# Altium project SmartEE.PrjPcb
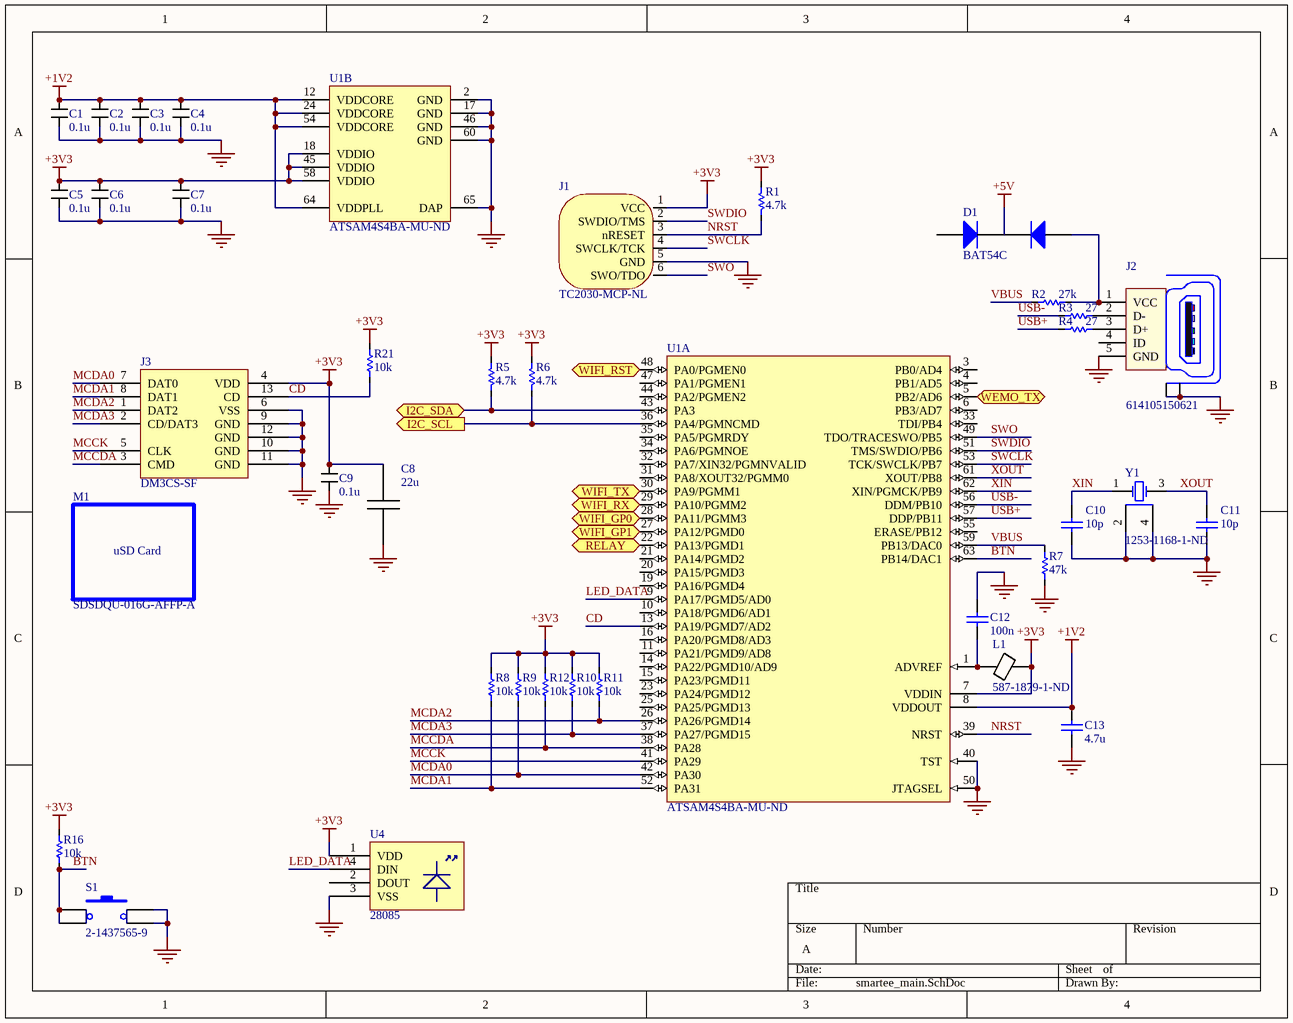
[diagram p0: smartee_main.SchDoc]
2 sheets, 57 parts. Net scope: flat (ports and power ports of the same name join across sheets).
Board file: smartee.PcbDoc
Sheets:
  smartee_main.SchDoc
  smartee_periph.SchDoc

## Sheet smartee_main.SchDoc
size A

### Parts
C1  0.1u  [R0603]
C2  0.1u  [R0603]
C3  0.1u  [R0603]
C4  0.1u  [R0603]
C5  0.1u  [R0603]
C6  0.1u  [R0603]
C7  0.1u  [R0603]
C8  22u  [0805]
C9  0.1u  [R0603]
C10  value 10p  [0603]  (hidden comment: CAP)
C11  value 10p  [0603]  (hidden comment: CAP)
C12  value 100n  [0603]  (hidden comment: CAP)
C13  value 4.7u  [0603]  (hidden comment: CAP)
D1  BAT54C  [SOT23]
J1  TC2030-MCP-NL  [TC2030-MCP-NL]  (no BOM)
J2  614105150621  [614105150621]
J3  DM3CS-SF  [DM3CS-SF]
L1  Supplier Part Number 1: 587-1879-1-ND  [0603]  (hidden comment: Ferrite)
M1  SDSDQU-016G-AFFP-A  (mechanical)
R1  value 4.7k  [0603]  (hidden comment: RES)
R2  value 27k  [0603]  (hidden comment: RES)
R3  value 27  [0603]  (hidden comment: RES)
R4  value 27  [0603]  (hidden comment: RES)
R5  value 4.7k  [0603]  (hidden comment: RES)
R6  value 4.7k  [0603]  (hidden comment: RES)
R7  value 47k  [0603]  (hidden comment: RES)
R8  value 10k  [0603]  (hidden comment: RES)
R9  value 10k  [0603]  (hidden comment: RES)
R10  value 10k  [0603]  (hidden comment: RES)
R11  value 10k  [0603]  (hidden comment: RES)
R12  value 10k  [0603]  (hidden comment: RES)
R16  value 10k  [0603]  (hidden comment: RES)
R21  value 10k  [0603]  (hidden comment: RES)
S1  2-1437565-9  [2-1437565-9]
U1  Supplier Part Number 1: ATSAM4S4BA-MU-ND  [QFN64]  (hidden comment: SAM4S)  (parts A,B of 2)
U4  28085  [WS2812B]
Y1  Supplier Part Number 1: 1253-1168-1-ND  [XTAL_3.2x2.5mm]  (hidden comment: XTAL)

### Ports
I2C_SCL (out), I2C_SDA (bidir), RELAY (out), WEMO_TX (in), WIFI_GP0 (bidir), WIFI_GP1 (bidir), WIFI_RST (out), WIFI_RX (out), WIFI_TX (in)

### Nets
+1V2: C1.1 C2.1 C3.1 C4.1 C13.2 U1.8(VDDOUT) U1.12(VDDCORE) U1.24(VDDCORE) U1.54(VDDCORE) U1.64(VDDPLL)
+3V3: C5.1 C6.1 C7.1 C8.1 C9.1 J1.1(VCC) J3.4(VDD) L1.1 R1.1 R5.1 R6.1 R8.2 R9.2 R10.2 R11.2 R12.2 R16.2 R21.2 U1.7(VDDIN) U1.18(VDDIO) U1.45(VDDIO) U1.58(VDDIO) U4.1(VDD)
+5V: D1.3(K)
GND: C1.2 C2.2 C3.2 C4.2 C5.2 C6.2 C7.2 C8.2 C9.2 C10.1 C11.1 C12.2 C13.1 J1.5(GND) J2.5(GND) J2.Z1(Shield) J2.Z2(Shield) J3.6(VSS) J3.9(GND) J3.10(GND) J3.11(GND) J3.12(GND) R7.1 S1.3 S1.4 U1.2(GND) U1.17(GND) U1.40(TST) U1.46(GND) U1.50(JTAGSEL) U1.60(GND) U1.65(DAP) U4.3(VSS) Y1.2(GND) Y1.4(GND)
BTN: R16.1 S1.1 S1.2 U1.63(PB14/DAC1)
CD: J3.13(CD) R21.1 U1.13(PA19/PGMD7/AD2)
LED_DATA: U1.9(PA17/PGMD5/AD0) U4.4(DIN)
MCCDA: J3.3(CMD) R12.1 U1.38(PA28)
MCCK: J3.5(CLK) U1.41(PA29)
MCDA0: J3.7(DAT0) R9.1 U1.42(PA30)
MCDA1: J3.8(DAT1) R8.1 U1.52(PA31)
MCDA2: J3.1(DAT2) R11.1 U1.26(PA26/PGMD14)
MCDA3: J3.2(CD/DAT3) R10.1 U1.37(PA27/PGMD15)
NRST: J1.3(nRESET) R1.2 U1.39(NRST)
SWCLK: J1.4(SWCLK/TCK) U1.53(TCK/SWCLK/PB7)
SWDIO: J1.2(SWDIO/TMS) U1.51(TMS/SWDIO/PB6)
SWO: J1.6(SWO/TDO) U1.49(TDO/TRACESWO/PB5)
USB+: R4.1 U1.57(DDP/PB11)
USB-: R3.1 U1.56(DDM/PB10)
VBUS: R2.1 R7.2 U1.59(PB13/DAC0)
XIN: C10.2 U1.62(XIN/PGMCK/PB9) Y1.1(OSC1)
XOUT: C11.2 U1.61(XOUT/PB8) Y1.3(OSC2)
NetC12_1: C12.1 L1.2 U1.1(ADVREF)
NetD1_1: D1.1(A1) J2.1(VCC) R2.2
NetJ2_2: J2.2(D-) R3.2
NetJ2_3: J2.3(D+) R4.2
NetJ4_1: U1.22(PA13/PGMD1) ; port RELAY
NetJ4_7: U1.5(PB2/AD6) ; port WEMO_TX
NetM3_2: U1.27(PA12/PGMD0) ; port WIFI_GP1
NetM3_3: U1.28(PA11/PGMM3) ; port WIFI_GP0
NetM3_4: U1.29(PA10/PGMM2) ; port WIFI_RX
NetM3_5: U1.30(PA9/PGMM1) ; port WIFI_TX
NetM3_7: U1.48(PA0/PGMEN0) ; port WIFI_RST
NetR5_2: R5.2 U1.43(PA3) ; port I2C_SDA
NetR6_2: R6.2 U1.36(PA4/PGMNCMD) ; port I2C_SCL

Not connected (* = marked no-connect by the designer): D1 2(A2); J2 4(ID); U1 3(PB0/AD4) 4(PB1/AD5) 6(PB3/AD7) 10(PA18/PGMD6/AD1) 11(PA21/PGMD9/AD8) 14(PA22/PGMD10/AD9) 15(PA23/PGMD11) 16(PA20/PGMD8/AD3) 19(PA16/PGMD4) 20(PA15/PGMD3) 21(PA14/PGMD2) 23(PA24/PGMD12) 25(PA25/PGMD13) 31(PA8/XOUT32/PGMM0) 32(PA7/XIN32/PGMNVALID) 33(TDI/PB4) 34(PA6/PGMNOE) 35(PA5/PGMRDY) 44(PA2/PGMEN2) 47(PA1/PGMEN1) 55(ERASE/PB12); U4 2(DOUT)

### Library data of the parts
C1-C7 C9 = CC0603ZRY5V9BB104: CAP CER 0.1UF 50V Y5V 0603; Manufacturer: Yageo; Capacitance: 0.1µF; Tolerance: -20%, +80%; Temperature Coefficient: Y5V (F); Supplier 1: Digi-Key; Manufacturer Part Number: CC0603ZRY5V9BB104; RoHS: RoHS Compliant; Category: Capacitors; Stock 1: 130366; Pricing 1: 1=0.1, 10=0.017, 25=0.012, 100=0.0078, 250=0.0064, 500=0.00546, 1000=0.00426 (USD); Packaging: Cut Tape (CT); Voltage - Rated: 50V; Mounting Type: Surface Mount, MLCC; Operating Temperature: -30°C ~ 85°C; Applications: General Purpose; Ratings: -; Package / Case: 0603 (1608 Metric); Size / Dimension: 0.063" L x 0.031" W (1.60mm x 0.80mm); Height - Seated (Max): -; Thickness (Max): 0.035" (0.90mm); Lead Spacing: -; Features: -; Lead Style: -; ComponentLink1URL: http://www.yageo.com/documents/recent/UPY-GPHC_Y5V_6.3V-to-50V_5_revised.pdf; ComponentLink1Description: http://www.yageo.com/documents/recent/UPY-GPHC_Y5V_6.3V-to-50V_5_revised.pdf; Supplier Part Number 1: 311-1343-1-ND; Value: 0.1u
C8 = CL21A226MAQNNNE: CAP CER 22UF 25V 20% X5R 0805; Manufacturer: Samsung Electro-Mechanics America, Inc; Capacitance: 22µF; Supplier 1: Digi-Key; Manufacturer Part Number: CL21A226MAQNNNE; RoHS: RoHS Compliant; Category: Capacitors; Stock 1: 750834; Pricing 1: 1=0.47, 10=0.411, 25=0.2936, 50=0.2496, 100=0.2055, 250=0.1644, 500=0.14972, 1000=0.13503 (USD); Packaging: Cut Tape (CT); Voltage - Rated: 25V; Tolerance: ±20%; Temperature Coefficient: X5R; Mounting Type: Surface Mount, MLCC; Operating Temperature: -55°C ~ 85°C; Applications: General Purpose; Ratings: -; Package / Case: 0805 (2012 Metric); Size / Dimension: 0.079" L x 0.049" W (2.00mm x 1.25mm); Height - Seated (Max): -; Thickness (Max): 0.055" (1.40mm); Lead Spacing: -; Features: -; Lead Style: -; ComponentLink1URL: http://www.samsungsem.com/servlet/FileDownload?type=spec&file=CL21A226MAQNNNE.pdf; ComponentLink1Description: http://www.samsungsem.com/servlet/FileDownload?type=spec&file=CL21A226MAQNNNE.pdf; Supplier Part Number 1: 1276-2908-1-ND
C10-C13 = CAP: Capacitor; Published: 8-Jun-2000; LatestRevisionDate: 17-Jul-2002; LatestRevisionNote: Re-released for DXP Platform.; Publisher: Altium Limited
D1 = BAT54C: DIODE SCHOTTKY 30V 200MA SOT23; Manufacturer: Fairchild Semiconductor; Diode Configuration: 1 Pair Common Cathode; Voltage - Forward (Vf) (Max) @ If: 800mV @ 100mA; Speed: Small Signal =< 200mA (Io), Any Speed; Reverse Recovery Time (trr): 5ns; Current - Reverse Leakage @ Vr: 2µA @ 25V; Supplier 1: Digi-Key; Manufacturer Part Number: BAT54C; RoHS: RoHS Compliant; Category: Discrete Semiconductor Products; Stock 1: 113590; Pricing 1: 1=0.2, 10=0.183, 25=0.166, 100=0.1196, 250=0.07044, 500=0.05844, 1000=0.03986 (USD); Packaging: Cut Tape (CT); Diode Type: Schottky; Voltage - DC Reverse (Vr) (Max): 30V; Current - Average Rectified (Io) (per Diode): 200mA; Mounting Type: Surface Mount; Package / Case: TO-236-3, SC-59, SOT-23-3; Supplier Device Package: SOT-23-3 (TO-236); ComponentLink1URL: http://www.fairchildsemi.com/ds/BA/BAT54.pdf; ComponentLink1Description: http://www.fairchildsemi.com/ds/BA/BAT54.pdf; Supplier Part Number 1: BAT54CFSCT-ND
J1 = TC2030-MCP-NL: Tag Connect
J2 = 614105150621: CONN RCPT USB TYPE AB; Manufacturer: Wurth Electronics Inc; Connector Type: USB - micro AB; Number of Contacts: 5; Gender: Receptacle; Specifications: USB 2.0; Supplier 1: Digi-Key; Manufacturer Part Number: 614105150621; RoHS: RoHS Compliant; Category: Connectors, Interconnects; Stock 1: 2977; Pricing 1: 1=2.16, 10=1.94, 50=1.8, 100=1.66, 500=1.44 (USD); Packaging: Cut Tape (CT); Mounting Type: Through Hole, Vertical; Features: Board Guide, Shielded; Ingress Protection: -; ComponentLink1URL: http://katalog.we-online.de/em/datasheet/614105150621.pdf; ComponentLink1Description: http://katalog.we-online.de/em/datasheet/614105150621.pdf; Supplier Part Number 1: 732-5959-1-ND
J3 = DM3CS-SF: CONN MICRO SD R/A HING TYPE SMD; Manufacturer: Hirose Electric Co Ltd; Card Type: Secure Digital - microSD™; Number of Positions: 10 (8 + 2); Connector Type: Connector and Ejector; Insertion, Removal Method: Hinged Lid; Supplier 1: Digi-Key; Manufacturer Part Number: DM3CS-SF; RoHS: RoHS Compliant; Category: Connectors, Interconnects; Stock 1: 22015; Pricing 1: 1=1.66, 10=1.509, 25=1.4168, 50=1.3552, 100=1.2936, 250=1.1704, 500=1.078 (USD); Packaging: Cut Tape (CT); Ejector Side: -; Mounting Type: Surface Mount, Right Angle; Features: Switch; Height Above Board: 0.072" (1.83mm); Mounting Feature: Normal, Standard - Top; Contact Finish: Gold; Contact Finish Thickness: -; ComponentLink1URL: http://www.hirose.co.jp/cataloge_hp/e60900232.pdf; ComponentLink1Description: http://www.hirose.co.jp/cataloge_hp/e60900232.pdf; Supplier Part Number 1: HR1972CT-ND
L1 = Ferrite: Ferrite bead; Code_IEC: 1005; Value: 10mH; Published: 8-Jun-2000; LatestRevisionDate: 29-May-2009; LatestRevisionNote: IPC-7351 Footprint Added.; Publisher: Altium Limited; Code_JEITA: 0402; Supplier 1: Digi-Key
M1 = uSD Card: 16 GB uSD Card
R1-R12 R16 R21 = RES: Resistor; Published: 8-Jun-2000; LatestRevisionDate: 17-Jul-2002; LatestRevisionNote: Re-released for DXP Platform.; Publisher: Altium Limited
S1 = 2-1437565-9: SWITCH TACTILE SPST-NO 0.05A 12V; Manufacturer: TE Connectivity; Switch Function: Off-Mom; Contact Rating @ Voltage: 0.05A @ 24VDC; Actuator Type: Standard; Actuator Height off PCB, from Pins: 4.30mm; Actuator Orientation: Top Actuated; Outline: 6.00mm x 6.00mm; Illumination: Non-Illuminated; Operating Force: 260gf; Actuator Material: Polyamide (PA), Nylon; Switch Travel: 0.25mm; Mechanical Life: 100,000 Cycles; Supplier 1: Digi-Key; Manufacturer Part Number: 2-1437565-9; RoHS: RoHS Compliant; Category: Switches; Stock 1: 3222; Pricing 1: 1=0.25, 10=0.245, 25=0.2364, 50=0.228, 100=0.2154, 250=0.20276, 500=0.1943 (USD); Packaging: Cut Tape (CT); Circuit: SPST-NO; Mounting Type: Surface Mount; Termination Style: Gull Wing; Illumination Voltage (Nominal): -; Illumination Type, Color: -; Ingress Protection: -; Features: -; Operating Temperature: -35°C ~ 85°C; ComponentLink1URL: http://www.te.com/commerce/DocumentDelivery/DDEController?Action=srchrtrv&DocNm=2-1437565-7&DocType=Customer+Drawing&DocLang=English; ComponentLink1Description: http://www.te.com/commerce/DocumentDelivery/DDEController?Action=srchrtrv&DocNm=2-1437565-7&DocType=Customer+Drawing&DocLang=English; Supplier Part Number 1: 450-1792-1-ND
U1 = SAM4S: Atmel SAM4S microcontroller, 64 pin; Supplier 1: Digi-Key
U4 = 28085: WS2812 LED MODULE; Manufacturer: Parallax Inc; Wavelength: 623nm Red, 524nm Green, 466nm Blue; Configuration: Square; Voltage - Forward (Vf) (Typ): 2.1V Red, 3.2V Green, 3.2V Blue; Lens Type: Flat; Supplier 1: Digi-Key; Manufacturer Part Number: 28085; RoHS: RoHS Compliant; Category: Optoelectronics; Stock 1: 0; Pricing 1: 1=1.79 (USD); Packaging: -; Type: LED Engine; Color: Red, Green, Blue (RGB); CCT (K): -; Flux @ Current/Temperature - Test: -; Current - Test: -; Temperature - Test: -; Lumens/Watt @ Current - Test: -; Current - Max: -; CRI (Color Rendering Index): -; Viewing Angle: -; Features: -; Size / Dimension: 5.00mm L x 5.00mm W; Height: -; Light Emitting Surface (LES): -; ComponentLink1URL: http://www.parallax.com/sites/default/files/downloads/28085-WS2812B-RGB-LED-Datasheet.pdf; ComponentLink1Description: http://www.parallax.com/sites/default/files/downloads/28085-WS2812B-RGB-LED-Datasheet.pdf; Supplier Part Number 1: 28085-ND
Y1 = XTAL: Crystal Oscillator; Published: 8-Jun-2000; LatestRevisionDate: 17-Jul-2002; LatestRevisionNote: Re-released for DXP Platform.; Publisher: Altium Limited; Supplier 1: Digi-Key

## Sheet smartee_periph.SchDoc
size A
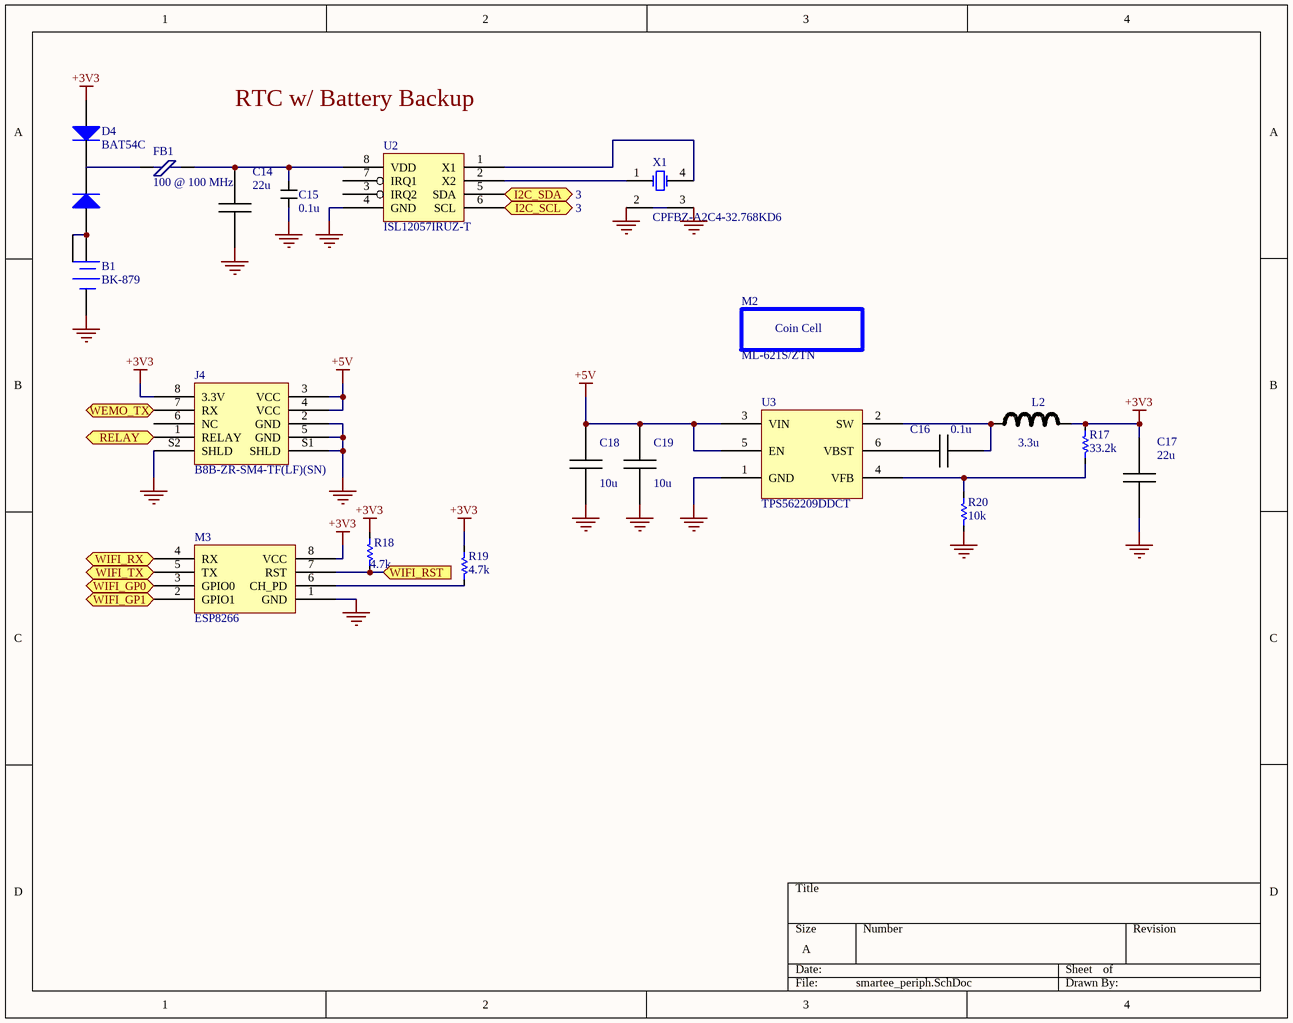
[diagram p1: smartee_periph.SchDoc]

### Parts
B1  BK-879  [BK-879]
C14  22u  [0805]
C15  0.1u  [R0603]
C16  0.1u  [0805]
C17  22u  [1206]
C18  10u  [0805]
C19  10u  [0805]
D4  BAT54C  [SOT23]
FB1  100 @ 100 MHz  [0603]
J4  B8B-ZR-SM4-TF(LF)(SN)  [B8B-ZR-SM4-TF]
L2  3.3u  [0805]
M2  ML-621S/ZTN  (mechanical)
M3  ESP8266  [ESP8266]
R17  value 33.2k  [0603]  (hidden comment: RES)
R18  value 4.7k  [0603]  (hidden comment: RES)
R19  value 4.7k  [0603]  (hidden comment: RES)
R20  value 10k  [0603]  (hidden comment: RES)
U2  ISL12057IRUZ-T  [UTDFN8]
U3  TPS562209DDCT  [TSOP-6]
X1  CPFBZ-A2C4-32.768KD6  [XTAL]

### Ports
I2C_SCL (in, see 3), I2C_SDA (bidir, see 3), RELAY (in), WEMO_TX (out), WIFI_GP0 (bidir), WIFI_GP1 (bidir), WIFI_RST (in), WIFI_RX (in), WIFI_TX (out)

### Nets
+3V3: C17.1 D4.2(A2) J4.8(3.3V) L2.2 M3.8(VCC) R17.1 R18.1 R19.1
+5V: C18.1 C19.1 J4.3(VCC) J4.4(VCC) U3.3(VIN) U3.5(EN)
GND: B1.N C14.2 C15.2 C17.2 C18.2 C19.2 J4.2(GND) J4.5(GND) J4.S1(SHLD) J4.S2(SHLD) M3.1(GND) R20.2 U2.4(GND) U3.1(GND) X1.2 X1.3
NetB1_P1: B1.P1 B1.P2 D4.1(A1)
NetC14_1: C14.1 C15.1 FB1.2 U2.8(VDD)
NetC16_1: C16.1 U3.6(VBST)
NetC16_2: C16.2 L2.1 U3.2(SW)
NetD4_3: D4.3(K) FB1.1
NetJ4_1: J4.1(RELAY) ; port RELAY
NetJ4_7: J4.7(RX) ; port WEMO_TX
NetM3_2: M3.2(GPIO1) ; port WIFI_GP1
NetM3_3: M3.3(GPIO0) ; port WIFI_GP0
NetM3_4: M3.4(RX) ; port WIFI_RX
NetM3_5: M3.5(TX) ; port WIFI_TX
NetM3_6: M3.6(CH_PD) R19.2
NetM3_7: M3.7(RST) R18.2 ; port WIFI_RST
NetR5_2: U2.5(SDA) ; port I2C_SDA
NetR6_2: U2.6(SCL) ; port I2C_SCL
NetR17_2: R17.2 R20.1 U3.4(VFB)
NetU2_1: U2.1(X1) X1.4
NetU2_2: U2.2(X2) X1.1(OSC1)

Not connected (* = marked no-connect by the designer): J4 6(NC); U2 3(IRQ2) 7(IRQ1)

### Notes on the sheet
- RTC w/ Battery Backup
- (in symbol ML-621S/ZTN) Coin Cell

### Library data of the parts
B1 = BK-879: HOLDER 6.8MM COIN CELL SMD; Manufacturer: MPD (Memory Protection Devices); Battery Type, Function: Coin Cell, Retainer; Style: Retainer; Battery Cell Size: Coin, 6.8mm; Number of Cells: 1; Battery Series: 364, 621; Supplier 1: Digi-Key; Manufacturer Part Number: BK-879; RoHS: RoHS Compliant; Category: Battery Products; Stock 1: 1702; Pricing 1: 1=0.32, 10=0.3, 100=0.27, 500=0.24, 1000=0.2 (USD); Mounting Type: PCB, Surface Mount; Termination Style: SMD (SMT) Tab; Height Above Board: 0.110" (2.80mm); Operating Temperature: -; ComponentLink1URL: http://www.memoryprotectiondevices.com/datasheets/BK-879-datasheet.pdf; ComponentLink1Description: http://www.memoryprotectiondevices.com/datasheets/BK-879-datasheet.pdf; Supplier Part Number 1: BK-879-ND
C14 = CL21A226MAQNNNE: as C8 on sheet smartee_main; Supplier 1: Digi-Key; Manufacturer Part Number: CL21A226MAQNNNE; RoHS: RoHS Compliant; Category: Capacitors; Stock 1: 750834; Pricing 1: 1=0.47, 10=0.411, 25=0.2936, 50=0.2496, 100=0.2055, 250=0.1644, 500=0.14972, 1000=0.13503 (USD); Packaging: Cut Tape (CT); Voltage - Rated: 25V; Tolerance: ±20%; Temperature Coefficient: X5R; Mounting Type: Surface Mount, MLCC; Operating Temperature: -55°C ~ 85°C; Applications: General Purpose; Ratings: -; Package / Case: 0805 (2012 Metric); Size / Dimension: 0.079" L x 0.049" W (2.00mm x 1.25mm); Height - Seated (Max): -; Thickness (Max): 0.055" (1.40mm); Lead Spacing: -; Features: -; Lead Style: -; ComponentLink1URL: http://www.samsungsem.com/servlet/FileDownload?type=spec&file=CL21A226MAQNNNE.pdf; ComponentLink1Description: http://www.samsungsem.com/servlet/FileDownload?type=spec&file=CL21A226MAQNNNE.pdf; Supplier Part Number 1: 1276-2908-1-ND
C15 = CC0603ZRY5V9BB104: as C1 on sheet smartee_main; Supplier 1: Digi-Key; Manufacturer Part Number: CC0603ZRY5V9BB104; RoHS: RoHS Compliant; Category: Capacitors; Stock 1: 130366; Pricing 1: 1=0.1, 10=0.017, 25=0.012, 100=0.0078, 250=0.0064, 500=0.00546, 1000=0.00426 (USD); Packaging: Cut Tape (CT); Voltage - Rated: 50V; Mounting Type: Surface Mount, MLCC; Operating Temperature: -30°C ~ 85°C; Applications: General Purpose; Ratings: -; Package / Case: 0603 (1608 Metric); Size / Dimension: 0.063" L x 0.031" W (1.60mm x 0.80mm); Height - Seated (Max): -; Thickness (Max): 0.035" (0.90mm); Lead Spacing: -; Features: -; Lead Style: -; ComponentLink1URL: http://www.yageo.com/documents/recent/UPY-GPHC_Y5V_6.3V-to-50V_5_revised.pdf; ComponentLink1Description: http://www.yageo.com/documents/recent/UPY-GPHC_Y5V_6.3V-to-50V_5_revised.pdf; Supplier Part Number 1: 311-1343-1-ND; Value: 0.1u
C16 = 08053C104KAT2A: CAP CER 0.1UF 25V 10% X7R 0805; Manufacturer: AVX Corporation; Capacitance: 0.1µF; Supplier 1: Digi-Key; Manufacturer Part Number: 08053C104KAT2A; RoHS: RoHS Compliant; Category: Capacitors; Stock 1: 1175205; Pricing 1: 1=0.1, 10=0.066, 100=0.0303, 250=0.02476, 500=0.02118, 1000=0.0165 (USD); Packaging: Cut Tape (CT); Tolerance: ±10%; Voltage - Rated: 25V; Temperature Coefficient: X7R; Mounting Type: Surface Mount, MLCC; Operating Temperature: -55°C ~ 125°C; Applications: General Purpose; Ratings: -; Package / Case: 0805 (2012 Metric); Size / Dimension: 0.079" L x 0.049" W (2.01mm x 1.25mm); Height - Seated (Max): -; Thickness (Max): 0.037" (0.94mm); Lead Spacing: -; Features: -; Lead Style: -; ComponentLink1URL: http://www.avx.com/docs/Catalogs/cx7r.pdf; ComponentLink1Description: http://www.avx.com/docs/Catalogs/cx7r.pdf; Supplier Part Number 1: 478-3755-1-ND
C17 = C3216X5R0J226K/1.6: CAP CER 22UF 6.3V 10% X5R 1206; Manufacturer: TDK Corporation; Capacitance: 22µF; Supplier 1: Digi-Key; Manufacturer Part Number: C3216X5R0J226K/1.6; RoHS: RoHS Compliant; Category: Capacitors; Stock 1: 117320; Pricing 1: 1=0.48, 10=0.42, 100=0.21, 250=0.168, 500=0.153, 1000=0.138 (USD); Packaging: Cut Tape (CT); Tolerance: ±10%; Voltage - Rated: 6.3V; Temperature Coefficient: X5R; Mounting Type: Surface Mount, MLCC; Operating Temperature: -55°C ~ 85°C; Applications: General Purpose; Ratings: -; Package / Case: 1206 (3216 Metric); Size / Dimension: 0.126" L x 0.063" W (3.20mm x 1.60mm); Height - Seated (Max): -; Thickness (Max): 0.071" (1.80mm); Lead Spacing: -; Features: -; Lead Style: -; ComponentLink1URL: http://media.digikey.com/pdf/Data%20Sheets/TDK%20PDFs/C_Series_GeneralAppl_B11.pdf; ComponentLink1Description: http://media.digikey.com/pdf/Data%20Sheets/TDK%20PDFs/C_Series_GeneralAppl_B11.pdf; Supplier Part Number 1: 445-4059-1-ND
C18 C19 = C0805C106K8PACTU: CAP CER 10UF 10V 10% X5R 0805; Manufacturer: Kemet; Capacitance: 10µF; Supplier 1: Digi-Key; Manufacturer Part Number: C0805C106K8PACTU; RoHS: RoHS Compliant; Category: Capacitors; Stock 1: 172957; Pricing 1: 1=0.21, 10=0.14, 50=0.085, 100=0.0714, 250=0.0578, 500=0.051, 1000=0.04335 (USD); Packaging: Cut Tape (CT); Tolerance: ±10%; Voltage - Rated: 10V; Temperature Coefficient: X5R; Mounting Type: Surface Mount, MLCC; Operating Temperature: -55°C ~ 85°C; Applications: General Purpose; Ratings: -; Package / Case: 0805 (2012 Metric); Size / Dimension: 0.079" L x 0.049" W (2.00mm x 1.25mm); Height - Seated (Max): -; Thickness (Max): 0.055" (1.40mm); Lead Spacing: -; Features: -; Lead Style: -; ComponentLink1URL: http://www.kemet.com/docfinder?Partnumber=C0805C106K8PACTU; ComponentLink1Description: http://www.kemet.com/docfinder?Partnumber=C0805C106K8PACTU; Supplier Part Number 1: 399-4925-1-ND
D4 = BAT54C: as D1 on sheet smartee_main; Supplier 1: Digi-Key; Manufacturer Part Number: BAT54C; RoHS: RoHS Compliant; Category: Discrete Semiconductor Products; Stock 1: 113590; Pricing 1: 1=0.2, 10=0.183, 25=0.166, 100=0.1196, 250=0.07044, 500=0.05844, 1000=0.03986 (USD); Packaging: Cut Tape (CT); Diode Type: Schottky; Voltage - DC Reverse (Vr) (Max): 30V; Current - Average Rectified (Io) (per Diode): 200mA; Mounting Type: Surface Mount; Package / Case: TO-236-3, SC-59, SOT-23-3; Supplier Device Package: SOT-23-3 (TO-236); ComponentLink1URL: http://www.fairchildsemi.com/ds/BA/BAT54.pdf; ComponentLink1Description: http://www.fairchildsemi.com/ds/BA/BAT54.pdf; Supplier Part Number 1: BAT54CFSCT-ND
FB1 = MPZ1608S101ATAH0: FERRITE CHIP 100 OHM 3A 0603; Manufacturer: TDK Corporation; Impedance @ Frequency: 100 Ohm @ 100MHz; DC Resistance (DCR): 30 mOhm Max; Filter Type: Differential Mode - Single; Supplier 1: Digi-Key; Manufacturer Part Number: MPZ1608S101ATAH0; RoHS: RoHS Compliant; Category: Filters; Stock 1: 219330; Pricing 1: 1=0.1, 10=0.079, 100=0.0472, 250=0.03432, 500=0.03146, 1000=0.02717 (USD); Packaging: Cut Tape (CT); Current Rating: 3A; Package / Case: 0603 (1608 Metric); Mounting Type: Surface Mount; Height (Max): 0.030" (0.75mm); Size / Dimension: 0.063" L x 0.031" W (1.60mm x 0.80mm); ComponentLink1URL: http://product.tdk.com/en/catalog/datasheets/beads_commercial_power_mpz_en.pdf; ComponentLink1Description: http://product.tdk.com/en/catalog/datasheets/beads_commercial_power_mpz_en.pdf; Supplier Part Number 1: 445-1564-1-ND
J4 = B8B-ZR-SM4-TF(LF)(SN): CONN HEADER ZH TOP 8POS 1.5MM; Manufacturer: JST Sales America Inc; Connector Type: Header, Shrouded; Number of Positions: 8; Number of Positions Loaded: All; Pitch: 0.059" (1.50mm); Supplier 1: Digi-Key; Manufacturer Part Number: B8B-ZR-SM4-TF(LF)(SN); RoHS: RoHS Compliant; Category: Connectors, Interconnects; Stock 1: 9275; Pricing 1: 1=0.84, 10=0.74, 25=0.6968, 50=0.6678, 100=0.6388, 250=0.58068, 500=0.52262 (USD); Packaging: Cut Tape (CT); Contact Type: Male Pin; Number of Rows: 1; Row Spacing: -; Contact Mating Length: -; Mounting Type: Surface Mount; Termination: Solder; Fastening Type: Detent Lock; Features: Solder Retention; Contact Finish: Tin; Contact Finish Thickness: -; Color: Natural; ComponentLink1URL: http://www.jst-mfg.com/product/pdf/eng/eZH.pdf; ComponentLink1Description: http://www.jst-mfg.com/product/pdf/eng/eZH.pdf; Supplier Part Number 1: 455-1687-1-ND
L2 = MLP2012S3R3MT0S1: FIXED IND 3.3UH 900MA 190 MOHM; Manufacturer: TDK Corporation; Type: Multilayer; Material - Core: Ferrite; Inductance: 3.3µH; Tolerance: ±20%; Shielding: Shielded; Frequency - Test: 2MHz; Supplier 1: Digi-Key; Manufacturer Part Number: MLP2012S3R3MT0S1; RoHS: RoHS Compliant; Category: Inductors, Coils, Chokes; Stock 1: 8776; Pricing 1: 1=0.36, 10=0.328, 50=0.2548, 100=0.2366, 500=0.20748, 1000=0.16744 (USD); Packaging: Cut Tape (CT); Current Rating: 900mA; Current - Saturation: -; DC Resistance (DCR): 190 mOhm; Q @ Freq: -; Frequency - Self Resonant: -; Operating Temperature: -40°C ~ 125°C; Mounting Type: Surface Mount; Package / Case: 0805 (2012 Metric); Size / Dimension: 0.079" L x 0.049" W (2.00mm x 1.25mm); Height - Seated (Max): 0.039" (1.00mm); Supplier Device Package: 0805 (2012 Metric); ComponentLink1URL: http://product.tdk.com/en/catalog/datasheets/inductor_commercial_power_mlp_en.pdf; ComponentLink1Description: http://product.tdk.com/en/catalog/datasheets/inductor_commercial_power_mlp_en.pdf; Supplier Part Number 1: 445-6365-1-ND
M2 = ML-621S/ZTN: BATTERY LITHIUM 3V RECHARGE; Manufacturer: Panasonic - BSG; Battery Cell Size: Coin, 6.8mm; Capacity: 5mAh; Discharge Rate: 10µA; Standard Charge Current: 600µA; Shipping Info: Due to possible restrictions, a change in ship method may be required.; Supplier 1: Digi-Key; Manufacturer Part Number: ML-621S/ZTN; RoHS: RoHS Compliant By Exemption; Category: Battery Products; Stock 1: 45217; Pricing 1: 1=1.78, 10=1.598, 50=1.42, 100=1.2425, 250=1.136, 500=1.065, 2000=0.97625, 4000=0.9443 (USD); Battery Chemistry: Lithium; Voltage - Rated: 3V; Size / Dimension: 0.27" Dia x 0.09" H (6.8mm x 2.2mm); Termination Style: Requires Holder; Standard Charge Time: -; Weight: 0.01 oz (0.28g); ComponentLink1URL: http://na.industrial.panasonic.com/sites/default/pidsa/files/mlseries_datasheets_merged.pdf; ComponentLink1Description: http://na.industrial.panasonic.com/sites/default/pidsa/files/mlseries_datasheets_merged.pdf; Supplier Part Number 1: P007-ND
M3 = ESP8266: WiFi UART module
R17-R20 = RES: Resistor; Published: 8-Jun-2000; LatestRevisionDate: 17-Jul-2002; LatestRevisionNote: Re-released for DXP Platform.; Publisher: Altium Limited
U2 = ISL12057IRUZ-T: IC RTC CLK/CALENDAR I2C 8-UTDFN; Manufacturer: Intersil; Time Format: HH:MM:SS (12/24 hr); Date Format: YY-MM-DD-dd; Interface: I²C, 2-Wire Serial; Voltage - Supply: 1.8 V ~ 3.6 V; Current - Timekeeping (Max): 0.65µA @ 1.8V; Supplier 1: Digi-Key; Manufacturer Part Number: ISL12057IRUZ-T; RoHS: RoHS Compliant; Category: Integrated Circuits (ICs); Stock 1: 2898; Pricing 1: 1=2.65, 25=1.98, 100=1.68 (USD); Packaging: Cut Tape (CT); Type: Clock/Calendar; Features: Alarm, Leap Year; Memory Size: -; Voltage - Supply, Battery: -; Operating Temperature: -40°C ~ 85°C; Mounting Type: Surface Mount; Package / Case: 8-UFDFN; Supplier Device Package: *; ComponentLink1URL: http://www.intersil.com/content/dam/Intersil/documents/fn67/fn6755.pdf; ComponentLink1Description: http://www.intersil.com/content/dam/Intersil/documents/fn67/fn6755.pdf; Supplier Part Number 1: ISL12057IRUZ-TCT-ND
U3 = TPS562209DDCT: IC REG BUCK SYNC ADJ 2A SOT-23-6; Manufacturer: Texas Instruments; Output Type: Adjustable; Number of Outputs: 1; Voltage - Output: 0.76 V ~ 7 V; Voltage - Input: 4.5 V ~ 17 V; Frequency - Switching: 650kHz; Synchronous Rectifier: Yes; Supplier 1: Digi-Key; Manufacturer Part Number: TPS562209DDCT; RoHS: RoHS Compliant; Category: Integrated Circuits (ICs); Stock 1: 208; Pricing 1: 1=1.76, 10=1.554, 25=1.4024, 100=1.2272 (USD); Packaging: Cut Tape (CT); Type: Step-Down (Buck); Current - Output: 2A; Operating Temperature: -40°C ~ 85°C; Mounting Type: Surface Mount; Package / Case: SOT-23-6 Thin, TSOT-23-6; Supplier Device Package: SOT-6; ComponentLink1URL: http://www.ti.com/lit/ds/symlink/tps562209.pdf; ComponentLink1Description: http://www.ti.com/lit/ds/symlink/tps562209.pdf; Supplier Part Number 1: 296-37302-1-ND
X1 = CPFBZ-A2C4-32.768KD6: CRYSTAL 32.768KHZ 6PF SMD; Manufacturer: Cardinal Components Inc.; Frequency Tolerance: ±10ppm; ESR (Equivalent Series Resistance): 50 kOhm; Operating Mode: Fundamental; Supplier 1: Digi-Key; Manufacturer Part Number: CPFBZ-A2C4-32.768KD6; RoHS: RoHS Compliant; Category: Crystals and Oscillators; Stock 1: 6155; Pricing 1: 1=0.61, 10=0.511, 50=0.4588, 100=0.4082, 500=0.3888, 1000=0.32659 (USD); Packaging: Cut Tape (CT); Type: kHz Crystal (Tuning Fork); Frequency: 32.768kHz; Frequency Stability: -; Load Capacitance: 6pF; Operating Temperature: -40°C ~ 85°C; Ratings: -; Mounting Type: Surface Mount; Package / Case: 4-SMD; Size / Dimension: 0.343" L x 0.146" W (8.70mm x 3.70mm); Height: 0.098" (2.50mm); ComponentLink1URL: http://www.cardinalxtal.com/uploads/files/cpfb.pdf; ComponentLink1Description: http://www.cardinalxtal.com/uploads/files/cpfb.pdf; Supplier Part Number 1: 370-1057-1-ND

## Nets that join several sheets
+3V3: smartee_main (23 pins), smartee_periph (8 pins)
+5V: smartee_main (D1.3), smartee_periph (6 pins)
GND: smartee_main (35 pins), smartee_periph (16 pins)
NetJ4_1: smartee_main (U1.22), smartee_periph (J4.1)
NetJ4_7: smartee_main (U1.5), smartee_periph (J4.7)
NetM3_2: smartee_main (U1.27), smartee_periph (M3.2)
NetM3_3: smartee_main (U1.28), smartee_periph (M3.3)
NetM3_4: smartee_main (U1.29), smartee_periph (M3.4)
NetM3_5: smartee_main (U1.30), smartee_periph (M3.5)
NetM3_7: smartee_main (U1.48), smartee_periph (M3.7 R18.2)
NetR5_2: smartee_main (R5.2 U1.43), smartee_periph (U2.5)
NetR6_2: smartee_main (R6.2 U1.36), smartee_periph (U2.6)